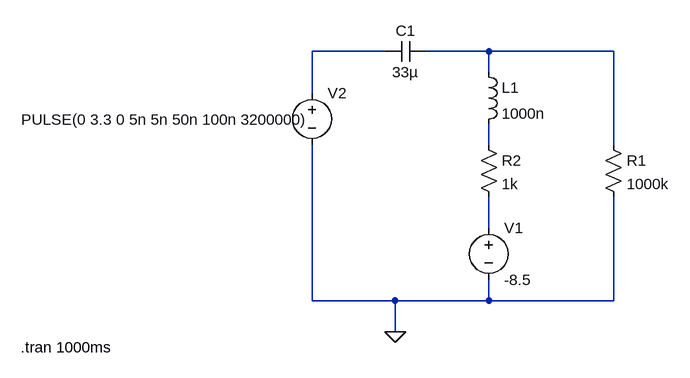
[diagram p0: schematic bias_tee.asc]
bias_tee.asc, the LTspice schematic file:
Version 4
SHEET 1 880 680
WIRE -144 -208 -256 -208
WIRE 16 -208 -80 -208
WIRE 208 -208 16 -208
WIRE 16 -176 16 -208
WIRE -256 -144 -256 -208
WIRE 16 -64 16 -96
WIRE 208 -64 208 -208
WIRE 16 64 16 16
WIRE -256 176 -256 -64
WIRE -128 176 -256 176
WIRE 16 176 16 144
WIRE 16 176 -128 176
WIRE 208 176 208 16
WIRE 208 176 16 176
WIRE -128 224 -128 176
FLAG -128 224 0
SYMBOL voltage 16 48 R0
WINDOW 123 0 0 Left 0
WINDOW 39 0 0 Left 0
SYMATTR InstName V1
SYMATTR Value -8.5
SYMBOL voltage -256 -160 R0
WINDOW 3 -447 57 Left 2
WINDOW 123 0 0 Left 0
WINDOW 39 0 0 Left 0
SYMATTR Value PULSE(0 3.3 0 5n 5n 50n 100n 3200000)
SYMATTR InstName V2
SYMBOL cap -80 -224 R90
WINDOW 0 0 32 VBottom 2
WINDOW 3 32 32 VTop 2
SYMATTR InstName C1
SYMATTR Value 33µ
SYMATTR SpiceLine V=10 Irms=15.2 Rser=0.00332739 Lser=0
SYMBOL ind 0 -192 R0
SYMATTR InstName L1
SYMATTR Value 1000n
SYMATTR SpiceLine Ipk=0.4 Rser=0.648 Rpar=94.2 Cpar=0
SYMBOL res 192 -80 R0
SYMATTR InstName R1
SYMATTR Value 1000k
SYMBOL res 0 -80 R0
SYMATTR InstName R2
SYMATTR Value 1k
TEXT -704 248 Left 2 !.tran 1000ms

The netlist it stands for:
* bias_tee.asc
V1 N004 0 -8.5
V2 N001 0 PULSE(0 3.3 0 5n 5n 50n 100n 3200000)
C1 N002 N001 33µ V=10 Irms=15.2 Rser=0.00332739 Lser=0
L1 N002 N003 1000n Ipk=0.4 Rser=0.648 Rpar=94.2 Cpar=0
R1 N002 0 1000k
R2 N003 N004 1k
.tran 1000ms
.backanno
.end